# Altium schematic sheet MOS管电机驱动电路.SchDoc
size A3
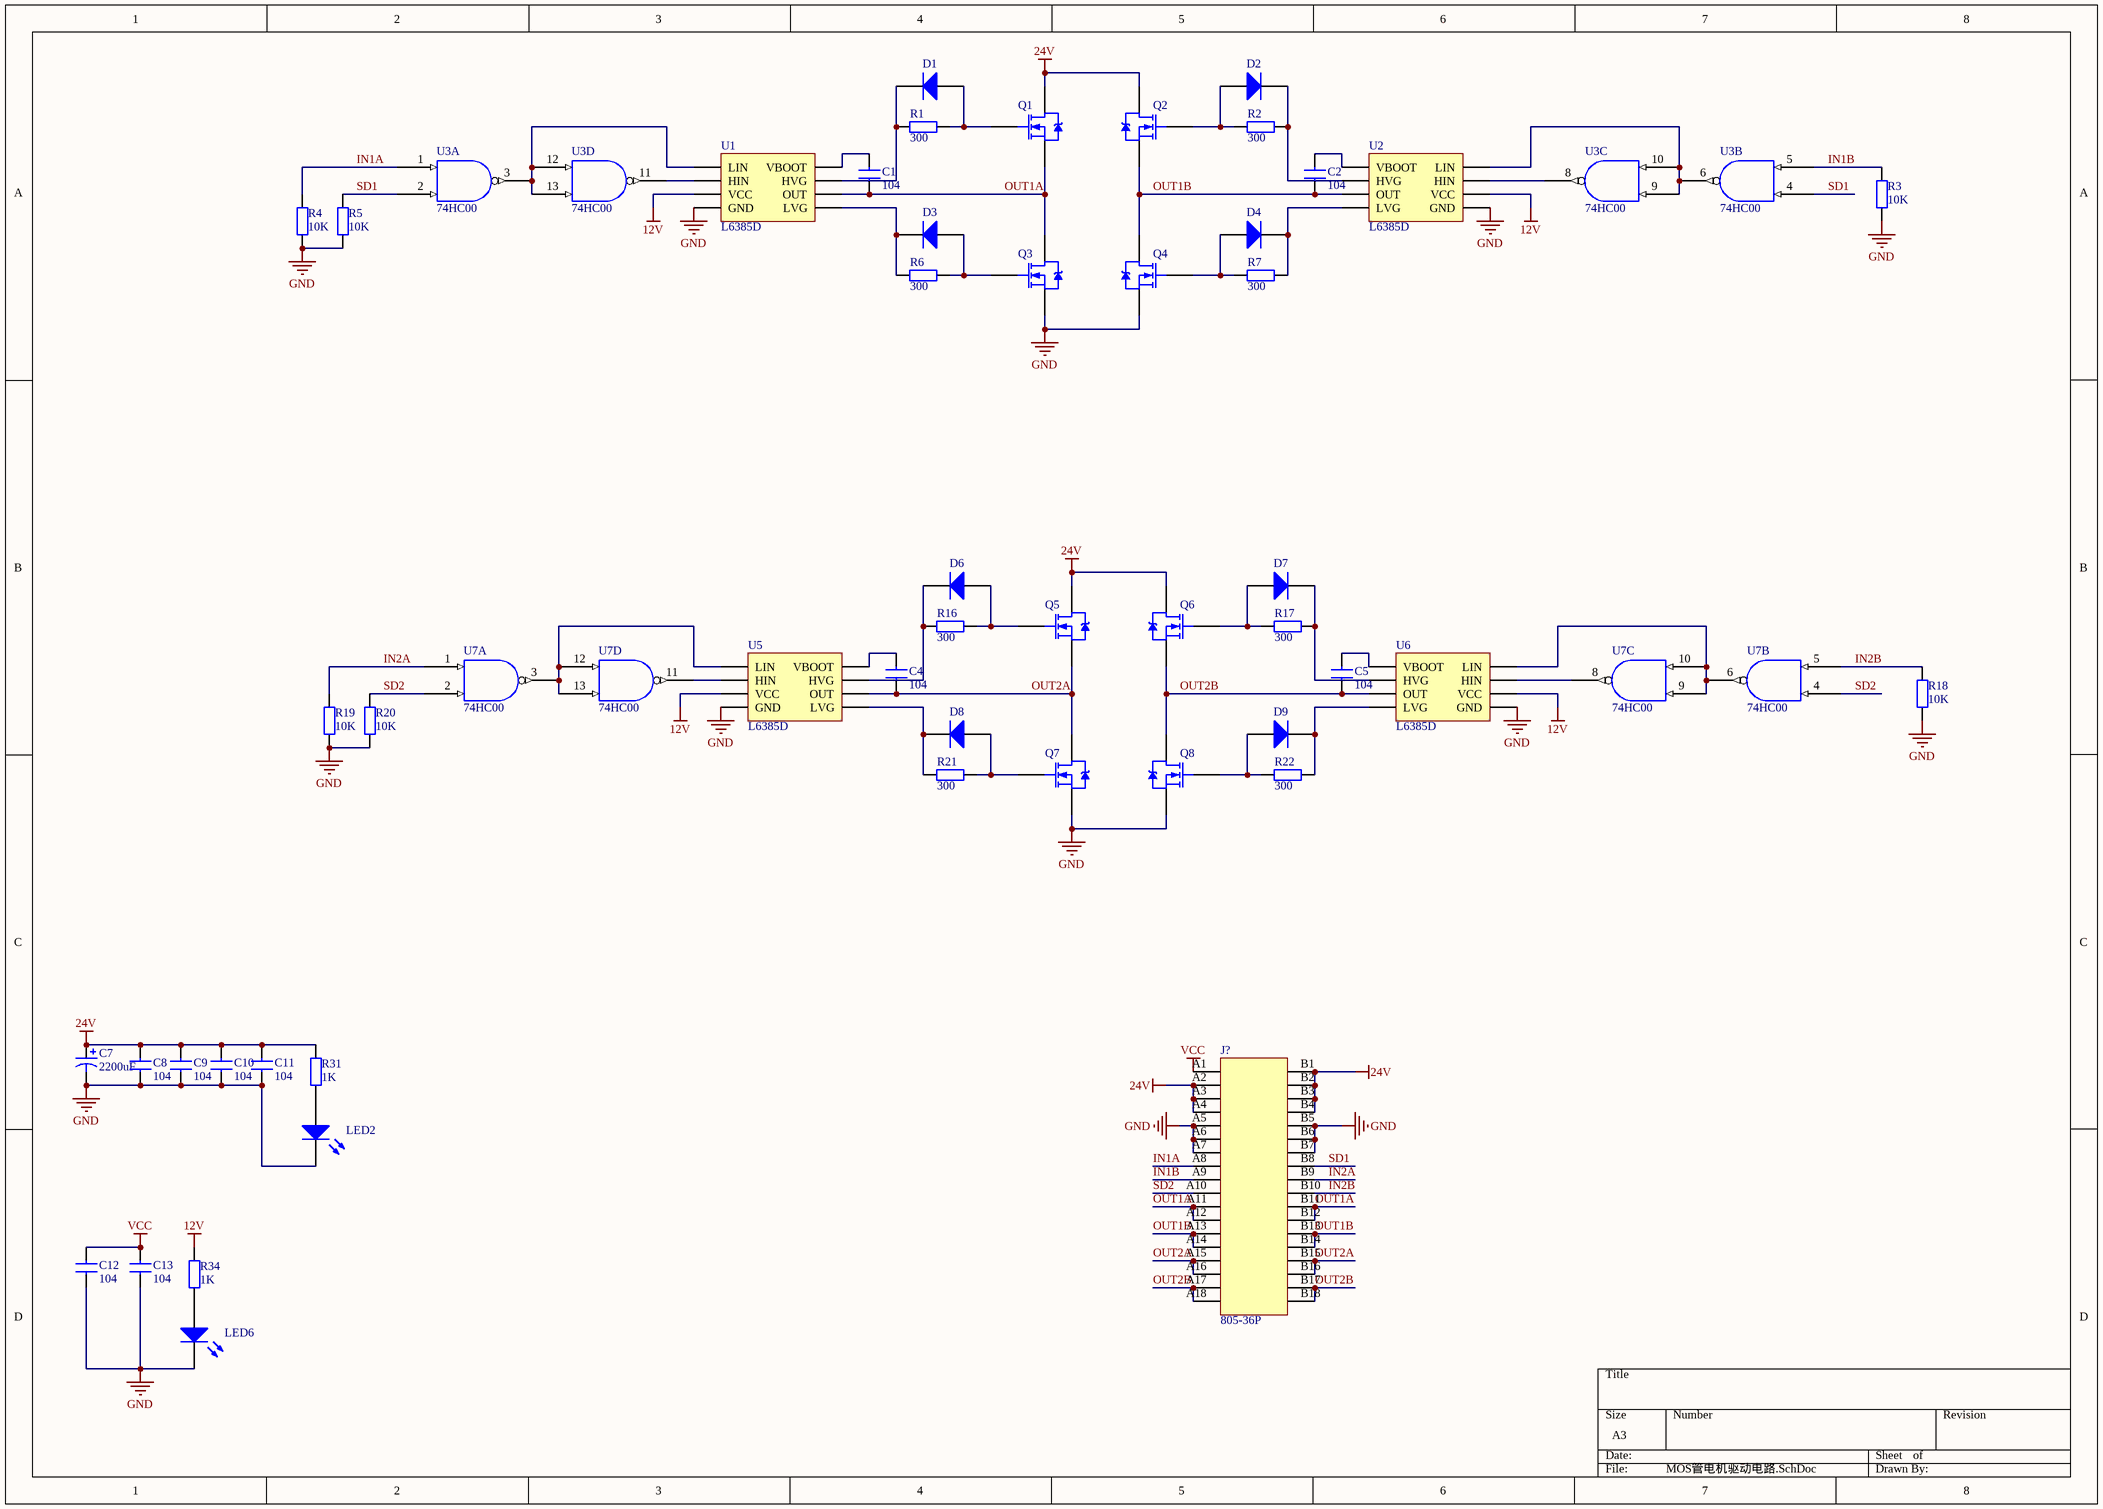
[diagram p0: MOS管电机驱动电路.SchDoc]

## Parts
C1  104  [C0603]
C2  104  [C0603]
C4  104  [C0603]
C5  104  [C0603]
C7  value 2200uF  [CAP 2200uf]  (hidden comment: Cap1)
C8  104  [C0603]
C9  104  [C0603]
C10  104  [C0603]
C11  104  [C0603]
C12  104  [C0603]
C13  104  [C0603]
D1  1N4148  [R0805]  (value not drawn)
D2  1N4148  [R0805]  (value not drawn)
D3  1N4148  [R0805]  (value not drawn)
D4  1N4148  [R0805]  (value not drawn)
D6  1N4148  [R0805]  (value not drawn)
D7  1N4148  [R0805]  (value not drawn)
D8  1N4148  [R0805]  (value not drawn)
D9  1N4148  [R0805]  (value not drawn)
J?  805-36P  [805-36P]
LED2  LED  [R0603]  (value not drawn)
LED6  LED  [R0603]  (value not drawn)
Q1  IRF3205  [DPAK]  (value not drawn)
Q2  IRF3205  [DPAK]  (value not drawn)
Q3  IRF3205  [DPAK]  (value not drawn)
Q4  IRF3205  [DPAK]  (value not drawn)
Q5  IRF3205  [DPAK]  (value not drawn)
Q6  IRF3205  [DPAK]  (value not drawn)
Q7  IRF3205  [DPAK]  (value not drawn)
Q8  IRF3205  [DPAK]  (value not drawn)
R1  value 300  [R0603]  (hidden comment: Res2)
R2  value 300  [R0603]  (hidden comment: Res2)
R3  value 10K  [R0603]  (hidden comment: Res2)
R4  value 10K  [R0603]  (hidden comment: Res2)
R5  value 10K  [R0603]  (hidden comment: Res2)
R6  value 300  [R0603]  (hidden comment: Res2)
R7  value 300  [R0603]  (hidden comment: Res2)
R16  value 300  [R0603]  (hidden comment: Res2)
R17  value 300  [R0603]  (hidden comment: Res2)
R18  value 10K  [R0603]  (hidden comment: Res2)
R19  value 10K  [R0603]  (hidden comment: Res2)
R20  value 10K  [R0603]  (hidden comment: Res2)
R21  value 300  [R0603]  (hidden comment: Res2)
R22  value 300  [R0603]  (hidden comment: Res2)
R31  value 1K  [R0603]  (hidden comment: Res2)
R34  value 1K  [R0603]  (hidden comment: Res2)
U1  L6385D  [SOIC8]
U2  L6385D  [SOIC8]
U3  74HC00  [SOP14-700]  (parts A,B,C,D of 4)
U5  L6385D  [SOIC8]
U6  L6385D  [SOIC8]
U7  74HC00  [SOP14-700]  (parts A,B,C,D of 4)

## Nets
12V: R34.1 U1.3(VCC) U2.3(VCC) U5.3(VCC) U6.3(VCC)
24V: C7.1 C8.1 C9.1 C10.1 C11.1 J?.A2 J?.A3 J?.A4 J?.B1 J?.B2 J?.B3 J?.B4 Q1.2(D) Q2.2(D) Q5.2(D) Q6.2(D) R31.1
GND: C7.2 C8.2 C9.2 C10.2 C11.2 C12.2 C13.2 J?.A5 J?.A6 J?.A7 J?.B5 J?.B6 J?.B7 LED2.2(K) LED6.2(K) Q3.3(S) Q4.3(S) Q7.3(S) Q8.3(S) R3.2 R4.2 R5.2 R18.2 R19.2 R20.2 U1.4(GND) U2.4(GND) U5.4(GND) U6.4(GND)
VCC: C12.1 C13.1 J?.A1
IN1A: J?.A8 R4.1 U3.1
IN1B: J?.A9 R3.1 U3.5
IN2A: J?.B9 R19.1 U7.1
IN2B: J?.B10 R18.1 U7.5
OUT1A: C1.2 J?.A11 J?.A12 J?.B11 J?.B12 Q1.3(S) Q3.2(D) U1.6(OUT)
OUT1B: C2.1 J?.A13 J?.A14 J?.B13 J?.B14 Q2.3(S) Q4.2(D) U2.6(OUT)
OUT2A: C4.2 J?.A15 J?.A16 J?.B15 J?.B16 Q5.3(S) Q7.2(D) U5.6(OUT)
OUT2B: C5.1 J?.A17 J?.A18 J?.B17 J?.B18 Q6.3(S) Q8.2(D) U6.6(OUT)
SD1: J?.B8 R5.1 U3.2 U3.4
SD2: J?.A10 R20.1 U7.2 U7.4
NetC1_1: C1.1 U1.8(VBOOT)
NetC2_2: C2.2 U2.8(VBOOT)
NetC4_1: C4.1 U5.8(VBOOT)
NetC5_2: C5.2 U6.8(VBOOT)
NetD1_1: D1.1(A) Q1.1(G) R1.1
NetD1_2: D1.2(K) R1.2 U1.7(HVG)
NetD2_1: D2.1(A) Q2.1(G) R2.2
NetD2_2: D2.2(K) R2.1 U2.7(HVG)
NetD3_1: D3.1(A) Q3.1(G) R6.1
NetD3_2: D3.2(K) R6.2 U1.5(LVG)
NetD4_1: D4.1(A) Q4.1(G) R7.2
NetD4_2: D4.2(K) R7.1 U2.5(LVG)
NetD6_1: D6.1(A) Q5.1(G) R16.1
NetD6_2: D6.2(K) R16.2 U5.7(HVG)
NetD7_1: D7.1(A) Q6.1(G) R17.2
NetD7_2: D7.2(K) R17.1 U6.7(HVG)
NetD8_1: D8.1(A) Q7.1(G) R21.1
NetD8_2: D8.2(K) R21.2 U5.5(LVG)
NetD9_1: D9.1(A) Q8.1(G) R22.2
NetD9_2: D9.2(K) R22.1 U6.5(LVG)
NetLED2_1: LED2.1(A) R31.2
NetLED6_1: LED6.1(A) R34.2
NetU1_1: U1.1(LIN) U3.3 U3.12 U3.13
NetU1_2: U1.2(HIN) U3.11
NetU2_1: U2.1(LIN) U3.6 U3.9 U3.10
NetU2_2: U2.2(HIN) U3.8
NetU5_1: U5.1(LIN) U7.3 U7.12 U7.13
NetU5_2: U5.2(HIN) U7.11
NetU6_1: U6.1(LIN) U7.6 U7.9 U7.10
NetU6_2: U6.2(HIN) U7.8

## Library data of the parts
C1 C2 C4 C5 C8-C13 = CAP: Capacitor
C7 = Cap1: Capacitor; Published: 8-Jun-2000; LatestRevisionDate: 17-Jul-2002; LatestRevisionNote: Re-released for DXP Platform.; PackageReference: POLAR0.8; Publisher: Altium Limited; PackageDescription: Polarized Capacitor; 2 Leads
D1-D4 D6-D9 = 1N4007: 1 Amp General Purpose Rectifier; Published: 8-Jun-2000; LatestRevisionDate: 17-Jul-2002; LatestRevisionNote: Re-released for DXP Platform.; DatasheetVersion: 1998; PackageVersion: Aug-1999; PackageReference: DO-41; Publisher: Altium Limited; PackageDescription: Diode, Axial; Body 5.2 x 2.7 mm (LxDia. max), Lead Dia. 0.86 mm (max); Code_JEDEC: DO-204-AL; ComponentLink1Description: Manufacturer Link; ComponentLink1URL: http://www.fairchildsemi.com/; ComponentLink2Description: Datasheet; ComponentLink2URL: http://www.fairchildsemi.com/ds/1N%2F1N4001.pdf
LED2 LED6 = LED: Typical BLUE SiC LED; Published: 8-Jun-2000; LatestRevisionDate: 17-Dec-2003; LatestRevisionNote: PCB Footprint replaced.; DatasheetVersion: 16-Apr-2002; PackageVersion: 16-Apr-2002; PackageReference: 3.5X2.8X1.9; Publisher: Altium Limited; PackageDescription: SM LED; 2 C-Bend Leads; Body 3.5 x 2.8 x 1.9 mm, inc leads (LxWxH typ)
Q1-Q8 = IRF3205: HEXFET Power MOSFET; Note: Pin 2 is electrically connected to pin 4.; Published: 8-Jun-2000; LatestRevisionDate: 17-Jul-2002; LatestRevisionNote: Re-released for DXP Platform.; DatasheetVersion: Aug-1997; PackageVersion: Feb-1997; PackageReference: TO-220AB; Publisher: Altium Limited; PackageDescription: TO, Thru-Hole, Vertical, Heatsink Mounted; 3 In-Line Leads; Pitch 2.54 mm; ComponentLink1Description: Manufacturer Link; ComponentLink1URL: http://www.irf.com/; ComponentLink2Description: Datasheet; ComponentLink2URL: http://www.irf.com/product-info/datasheets/data/irf3205.pdf
R1-R7 R16-R22 R31 R34 = Res2: Resistor; Published: 8-Jun-2000; LatestRevisionDate: 17-Jul-2002; LatestRevisionNote: Re-released for DXP Platform.; PackageReference: AXIAL-0.4; Publisher: Altium Limited; PackageDescription: Axial Device, Thru-Hole; 2 Leads; 0.4 in Pin Spacing